# Altium schematic sheet B293A PIC32.SchDoc: PIC32 Subsheet
size A3; ApprovedBy: Matt Southgate; CheckedBy: Matt Southgate; Author: Matt Southgate; CompanyName: Matt Southgate; DrawnBy: Matt Southgate; Engineer: Matt Southgate; DocumentNumber: 293; Revision: A; SheetNumber: 1; PageSetup: Record=PageOptions|CenterHorizontal=True|CenterVertical=True|PrintScale=1.39|XCorrection=1.00|YCorrection=1.00|PrintKind=1|BorderSize=5000000|LeftOffset=0|BottomOffset=0|Orientation=2|PaperLength=1000|PaperWidth=1000|Scale=100|PaperSource=15|PrintQuality=600|MediaType=1|DitherType=10|PaperKind=A3|PrintScaleMode=1
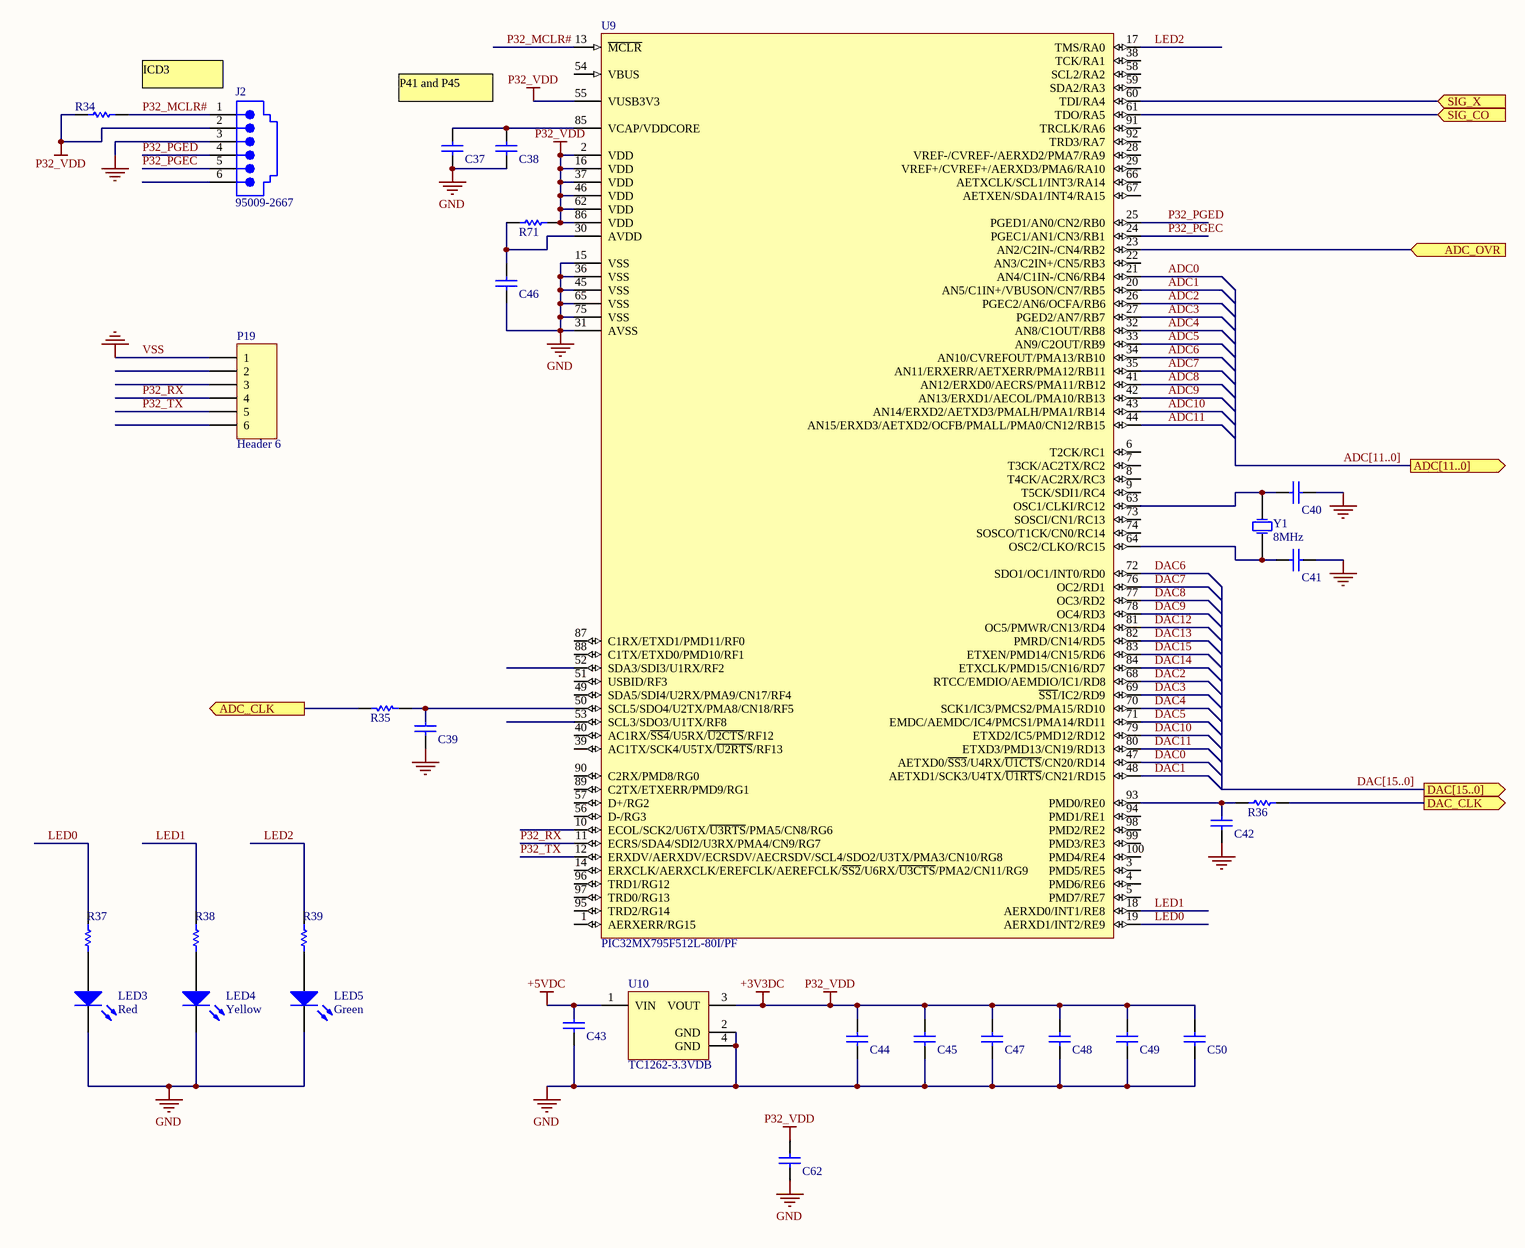
[diagram p0: B293A PIC32.SchDoc]

## Parts
C37  CAP 10uF 25V 0805(2012)  [CAPC0805(2012)145_N]  (value not drawn)
C38  CAP 100nF 50V 1206(3216)  [CAPC1206(3216)170_L]  (value not drawn)
C39  CAP 1uF 25V 0805(2012)  [CAPC0805(2012)100_N]  (value not drawn)
C40  CAP 15pF 50V 0805(2012)  [CAPC0805(2012)75_L]  (value not drawn)
C41  CAP 15pF 50V 0805(2012)  [CAPC0805(2012)75_L]  (value not drawn)
C42  CAP 1uF 25V 0805(2012)  [CAPC0805(2012)100_N]  (value not drawn)
C43  CAP 10uF 25V 0805(2012)  [CAPC0805(2012)145_N]  (value not drawn)
C44  CAP 100nF 50V 0603(1608)  [CAPC0603(1608)100_N]  (value not drawn)
C45  CAP 100nF 50V 0603(1608)  [CAPC0603(1608)100_N]  (value not drawn)
C46  CAP 100nF 50V 0603(1608)  [CAPC0603(1608)100_N]  (value not drawn)
C47  CAP 100nF 50V 0603(1608)  [CAPC0603(1608)100_N]  (value not drawn)
C48  CAP 100nF 50V 0603(1608)  [CAPC0603(1608)100_N]  (value not drawn)
C49  CAP 100nF 50V 0603(1608)  [CAPC0603(1608)100_N]  (value not drawn)
C50  CAP 100nF 50V 0603(1608)  [CAPC0603(1608)100_N]  (value not drawn)
C62  CAP 47uF 25V 2220(5750)  [CAPC2220(5750)230_N]  (value not drawn)
J2  95009-2667  [95009-2667]
LED3  Red  [1206 - LED]
LED4  Yellow  [1206 - LED]
LED5  Green  [1206 - LED]
P19  Header 6  [HDR1X6]
R34  10K 5% 0805(2012)  [RESC0805(2012)_L]  (value not drawn)
R35  10R 5% 0805(2012)  [RESC0805(2012)_L]  (value not drawn)
R36  220R 5% 0805(2012)  [RESC0805(2012)_L]  (value not drawn)
R37  1K 5% 0805(2012)  [RESC0805(2012)_N]  (value not drawn)
R38  1K 5% 0805(2012)  [RESC0805(2012)_N]  (value not drawn)
R39  1K 5% 0805(2012)  [RESC0805(2012)_N]  (value not drawn)
R71  10R 1% 0805(2012)  [RESC0805(2012)_M]  (value not drawn)
U9  PIC32MX795F512L-80I/PF  [TQFP-PF100_L]
U10  TC1262-3.3VDB  [SOT-223-DB3_L]
Y1  8MHz  [CRYSTAL_HC49-US-SM]

## Ports
ADC[11..0] (out), ADC_CLK (out), ADC_OVR (in), DAC[15..0] (out), DAC_CLK (out), SIG_CO (in), SIG_X (in)

## Nets
+3V3DC: C44.1 C45.1 C47.1 C48.1 C49.1 C50.1 C62.2 J2.2 R34.1 R71.2 U9.2(VDD) U9.16(VDD) U9.37(VDD) U9.46(VDD) U9.55(VUSB3V3) U9.62(VDD) U9.86(VDD) U10.3(VOUT)  [also labelled P32_VDD]
+5VDC: C43.1 U10.1(VIN)
VSS: C37.2 C38.2 C39.2 C40.1 C41.1 C42.2 C43.2 C44.2 C45.2 C46.2 C47.2 C48.2 C49.2 C50.2 C62.1 J2.3 LED3.K LED4.K LED5.K P19.1 U9.15(VSS) U9.31(AVSS) U9.36(VSS) U9.45(VSS) U9.65(VSS) U9.75(VSS) U10.2(GND) U10.4(GND)  [also labelled GND]
ADC0: U9.21(AN4/C1IN-/CN6/RB4)
ADC1: U9.20(AN5/C1IN+/VBUSON/CN7/RB5)
ADC2: U9.26(PGEC2/AN6/OCFA/RB6)
ADC3: U9.27(PGED2/AN7/RB7)
ADC4: U9.32(AN8/C1OUT/RB8)
ADC5: U9.33(AN9/C2OUT/RB9)
ADC6: U9.34(AN10/CVREFOUT/PMA13/RB10)
ADC7: U9.35(AN11/ERXERR/AETXERR/PMA12/RB11)
ADC8: U9.41(AN12/ERXD0/AECRS/PMA11/RB12)
ADC9: U9.42(AN13/ERXD1/AECOL/PMA10/RB13)
ADC10: U9.43(AN14/ERXD2/AETXD3/PMALH/PMA1/RB14)
ADC11: U9.44(AN15/ERXD3/AETXD2/OCFB/PMALL/PMA0/CN12/RB15)
ADC_CLK: R35.2 ; port ADC_CLK
ADC_OVR: U9.23(AN2/C2IN-/CN4/RB2) ; port ADC_OVR
DAC0: U9.47(AETXD0/~{SS3}/U4RX/~{U1CTS}/CN20/RD14)
DAC1: U9.48(AETXD1/SCK3/U4TX/~{U1RTS}/CN21/RD15)
DAC2: U9.68(RTCC/EMDIO/AEMDIO/IC1/RD8)
DAC3: U9.69(~{SS1}/IC2/RD9)
DAC4: U9.70(SCK1/IC3/PMCS2/PMA15/RD10)
DAC5: U9.71(EMDC/AEMDC/IC4/PMCS1/PMA14/RD11)
DAC6: U9.72(SDO1/OC1/INT0/RD0)
DAC7: U9.76(OC2/RD1)
DAC8: U9.77(OC3/RD2)
DAC9: U9.78(OC4/RD3)
DAC10: U9.79(ETXD2/IC5/PMD12/RD12)
DAC11: U9.80(ETXD3/PMD13/CN19/RD13)
DAC12: U9.81(OC5/PMWR/CN13/RD4)
DAC13: U9.82(PMRD/CN14/RD5)
DAC14: U9.84(ETXCLK/PMD15/CN16/RD7)
DAC15: U9.83(ETXEN/PMD14/CN15/RD6)
DAC_CLK: R36.2 ; port DAC_CLK
LED0: R37.2 U9.19(AERXD1/INT2/RE9)
LED1: R38.2 U9.18(AERXD0/INT1/RE8)
LED2: R39.2 U9.17(TMS/RA0)
P32_MCLR#: J2.1 R34.2 U9.13(~{MCLR})
P32_PGEC: J2.5 U9.24(PGEC1/AN1/CN3/RB1)
P32_PGED: J2.4 U9.25(PGED1/AN0/CN2/RB0)
P32_RX: P19.4 U9.11(ECRS/SDA4/SDI2/U3RX/PMA4/CN9/RG7)
P32_TX: P19.5 U9.12(ERXDV/AERXDV/ECRSDV/AECRSDV/SCL4/SDO2/U3TX/PMA3/CN10/RG8)
SIG_CO: U9.61(TDO/RA5) ; port SIG_CO
SIG_X: U9.60(TDI/RA4) ; port SIG_X
NetC37_1: C37.1 C38.1 U9.85(VCAP/VDDCORE)
NetC39_1: C39.1 R35.1 U9.50(SCL5/SDO4/U2TX/PMA8/CN18/RF5)
NetC40_2: C40.2 U9.63(OSC1/CLKI/RC12) Y1.1(OSC1)
NetC41_2: C41.2 U9.64(OSC2/CLKO/RC15) Y1.2(OSC2)
NetC42_1: C42.1 R36.1 U9.93(PMD0/RE0)
NetC46_1: C46.1 R71.1 U9.30(AVDD)
NetLED3_A: LED3.A R37.1
NetLED4_A: LED4.A R38.1
NetLED5_A: LED5.A R39.1

Not connected (* = marked no-connect by the designer): J2 6; P19 2 3 6; U9 1(AERXERR/RG15) 3(PMD5/RE5) 4(PMD6/RE6) 5(PMD7/RE7) 6(T2CK/RC1) 7(T3CK/AC2TX/RC2) 8(T4CK/AC2RX/RC3) 9(T5CK/SDI1/RC4) 10(ECOL/SCK2/U6TX/~{U3RTS}/PMA5/CN8/RG6) 14(ERXCLK/AERXCLK/EREFCLK/AEREFCLK/~{SS2}/U6RX/~{U3CTS}/PMA2/CN11/RG9) 22(AN3/C2IN+/CN5/RB3) 28(VREF-/CVREF-/AERXD2/PMA7/RA9) 29(VREF+/CVREF+/AERXD3/PMA6/RA10) 38(TCK/RA1) 39(AC1TX/SCK4/U5TX/~{U2RTS}/RF13) 40(AC1RX/~{SS4}/U5RX/~{U2CTS}/RF12) 49(SDA5/SDI4/U2RX/PMA9/CN17/RF4) 51(USBID/RF3) 52(SDA3/SDI3/U1RX/RF2) 53(SCL3/SDO3/U1TX/RF8) 54(VBUS) 56(D-/RG3) 57(D+/RG2) 58(SCL2/RA2) 59(SDA2/RA3) 66(AETXCLK/SCL1/INT3/RA14) 67(AETXEN/SDA1/INT4/RA15) 73(SOSCI/CN1/RC13) 74(SOSCO/T1CK/CN0/RC14) 87(C1RX/ETXD1/PMD11/RF0) 88(C1TX/ETXD0/PMD10/RF1) 89(C2TX/ETXERR/PMD9/RG1) 90(C2RX/PMD8/RG0) 91(TRCLK/RA6) 92(TRD3/RA7) 94(PMD1/RE1) 95(TRD2/RG14) 96(TRD1/RG12) 97(TRD0/RG13) 98(PMD2/RE2) 99(PMD3/RE3) 100(PMD4/RE4)

## Buses and harness runs
bus ADC[11..0] = port ADC[11..0]
bus DAC[15..0] = port DAC[15..0]

## Notes on the sheet
- ICD3
- P41 and P45
- Title
- Size:
- Date:
- A3
- Number:
- Time:
- Revision:
- Sheet
- of
- Engineer : Matthew Southgate
- Author    : Matthew Southgate
- File:

## Library data of the parts
C37 C43 = CMP-1036-04933-1: CAP 10uF 25V ±20% 0805 (2012 Metric) Thickness 1.45mm SMD; Case-EIA: 0805; Case-Metric: 2012; Technology: SMT; Tolerance: ±20%; Max Thickness: 1.45 mm; Value: 10uF; Rated Voltage: 25 V
C38 = CMP-1037-04201-1: CAP 100nF 50V ±10% 1206 (3216 Metric) Thickness 1.7mm SMD; Case-Metric: 3216; Case-EIA: 1206; Value: 100nF; Max Thickness: 1.7 mm; Rated Voltage: 50 V; Tolerance: ±10%; Technology: SMT
C39 C42 = CMP-1036-04756-1: CAP 1uF 25V ±20% 0805 (2012 Metric) Thickness 1mm SMD; Case-Metric: 2012; Case-EIA: 0805; Max Thickness: 1 mm; Tolerance: ±20%; Technology: SMT; Value: 1uF; Rated Voltage: 25 V
C40 C41 = CMP-1036-01043-1: CAP 15pF 50V ±10% 0805 (2012 Metric) Thickness 0.75mm SMD; Case-EIA: 0805; Case-Metric: 2012; Max Thickness: 0.75 mm; Rated Voltage: 50 V; Technology: SMT; Value: 15pF; Tolerance: ±10%
C44-C50 = CMP-1035-02592-1: CAP 100nF 50V ±10% 0603 (1608 Metric) Thickness 1mm SMD; Case-Metric: 1608; Case-EIA: 0603; Value: 100nF; Max Thickness: 1 mm; Rated Voltage: 50 V; Tolerance: ±10%; Technology: SMT
C62 = CMP-1042-00785-1: CAP 47uF 25V -20% to +80% 2220 (5750 Metric) Thickness 2.2mm SMD; Case-Metric: 5750; Case-EIA: 2220; Rated Voltage: 25 V; Tolerance: -20% to +80%; Technology: SMT; Value: 47uF; Max Thickness: 2.2 mm
J2 = 95009-2667: Right Angle, Standard Profile, Flush Mount PCB Jack; Ports: 1; Positions/Loaded: Port1 - 6/6; PerformanceCategory: 3; PCB_Mounting: Thru-Hole; DrillSize: Nominal, Rounded to nearest 0.05mm; PCB_Layout: Complies with Manufacturer's Recommendation.; Published: 25-Jun-2002; DatasheetDocument: 18-Dec-2001; PackageDocument: 18-Dec-2001; PackageReference: 95009-2667; Publisher: Altium Limited; ComponentLink1Description: Manufacturer Link; ComponentLink1URL: http://www.molex.com/
LED3 = LED 1206 RED: LED, ALINGAP, SMD, 1206, RED; Manufacturer Part Number: KPC-3216SURCK; Order Code: 1318261; Supplier: Farnell
LED4 = LED 1206 YELLOW: LED, ALINGAP, SMD, 1206, YELLOW; Manufacturer Part Number: KPC-3216SYCK; Order Code: 1318262; Supplier: Farnell
LED5 = LED 1206 GREEN: LED, SMD, 1206, CLR LENS, GREEN; Manufacturer Part Number: KPC-3216SGC; Order Code: 1318254; Supplier: Farnell
P19 = Header 6: Header, 6-Pin; LatestRevisionDate: 17-Jul-2002; LatestRevisionNote: Re-released for DXP Platform.; Publisher: Altium Limited
R34 = CMP-1013-00098-1: 10K 0.125W 5% 0805 (2012 Metric)  SMD; Case-Metric: 2012; Value: 10000.00 Ohm; Case-EIA: 0805; Power: 0.125 W; Technology: SMT; Tolerance: 5 %
R35 = CMP-1013-00026-1: 10R 0.125W 5% 0805 (2012 Metric)  SMD; Value: 10.00 Ohm; Case-Metric: 2012; Case-EIA: 0805; Technology: SMT; Tolerance: 5 %; Power: 0.125 W
R36 = CMP-1013-00058-1: 220R 0.125W 5% 0805 (2012 Metric)  SMD; Value: 220.00 Ohm; Case-EIA: 0805; Case-Metric: 2012; Tolerance: 5 %; Technology: SMT; Power: 0.125 W
R37-R39 = CMP-1013-00074-1: 1K 0.125W 5% 0805 (2012 Metric)  SMD; Case-Metric: 2012; Case-EIA: 0805; Value: 1000.00 Ohm; Tolerance: 5 %; Technology: SMT; Power: 0.125 W
R71 = CMP-1013-00284-1: 10R 0.125W 1% 0805 (2012 Metric)  SMD; Case-Metric: 2012; Value: 10.00 Ohm; Case-EIA: 0805; Tolerance: 1 %; Technology: SMT; Power: 0.125 W
U9 = CMP-0048-00315-1: High Performance 80 MHz MIPS-Based 32-Bit Flash Microcontroller with USB, CAN and Ethernet, 512KB Program Memory, 100-pin TQFP, Industrial Temperature; ComponentLink2Description: Packaging Specification; ComponentLink3URL: http://www.microchip.com/; ComponentLink2URL: http://ww1.microchip.com/downloads/en/PackagingSpec/en012702.pdf; DatasheetVersion: revG, May-2011; ComponentLink1Description: Datasheet; PackageVersion: revBB, Aug-2009; ComponentLink3Description: Microchip.com Home; ComponentLink1URL: http://ww1.microchip.com/downloads/en/DeviceDoc/61156G.pdf; PackageDescription: 100-Lead Thin Plastic Quad Flat Pack (PF) - 14x14x1mm Body, 2.00mm [TQFP]; PackageReference: TQFP-PF100
U10 = CMP-0136-00483-1: 500mA Fixed Output CMOS LDO, 3-Pin SOT-223, Extended Temperature; PackageVersion: revBB, Aug-2009; DatasheetVersion: revB, 2002; PackageDescription: 3-Lead Plastic Small Outline Transistor (DB) [SOT-223]; PackageReference: SOT-223-DB3
Y1 = SMD Crystal 8HMz HC-49: CRYSTAL, 8MHZ, 16PF, SMD; Manufacturer Part Number: HC49SM-8-30-50-60-16-ATF; Supplier: Onecall; Supplier Part Number: 1667012